# Altium schematic sheet Altera_Array_TOP.SchDoc
size A
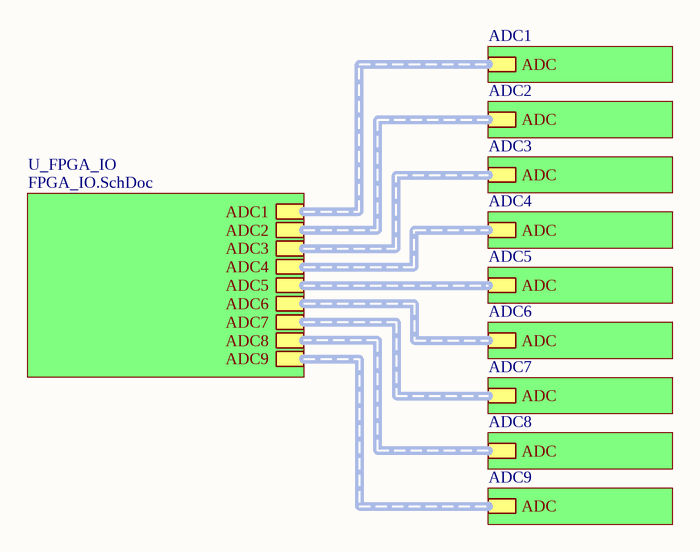
[diagram p0: Altera_Array_TOP.SchDoc]

## Sub-sheets
ADC1 = ADC_Connector.SchDoc: ADC (harness ADC)
ADC2 = ADC_Connector.SchDoc: ADC (harness ADC)
ADC3 = ADC_Connector.SchDoc: ADC (harness ADC)
ADC4 = ADC_Connector.SchDoc: ADC (harness ADC)
ADC5 = ADC_Connector.SchDoc: ADC (harness ADC)
ADC6 = ADC_Connector.SchDoc: ADC (harness ADC)
ADC7 = ADC_Connector.SchDoc: ADC (harness ADC)
ADC8 = ADC_Connector.SchDoc: ADC (harness ADC)
ADC9 = ADC_Connector.SchDoc: ADC (harness ADC)
U_FPGA_IO = FPGA_IO.SchDoc: ADC1 (harness ADC), ADC4 (harness ADC), ADC8 (harness ADC), ADC5 (harness ADC), ADC9 (harness ADC), ADC2 (harness ADC), ADC3 (harness ADC), ADC7 (harness ADC), ADC6 (harness ADC)

## Buses and harness runs
harness sheet ADC1/ADC = sheet U_FPGA_IO/ADC1
harness sheet ADC2/ADC = sheet U_FPGA_IO/ADC2
harness sheet ADC3/ADC = sheet U_FPGA_IO/ADC3
harness sheet ADC4/ADC = sheet U_FPGA_IO/ADC4
harness sheet ADC5/ADC = sheet U_FPGA_IO/ADC5
harness sheet ADC6/ADC = sheet U_FPGA_IO/ADC6
harness sheet ADC7/ADC = sheet U_FPGA_IO/ADC7
harness sheet ADC8/ADC = sheet U_FPGA_IO/ADC8
harness sheet ADC9/ADC = sheet U_FPGA_IO/ADC9